# Altium schematic sheet 01 REVISION HISTORY.SchDoc
size 420 x 297 mm; Organization: Altium Limited; Address1: L3, 12a Rodborough Rd; Address2: Frenchs Forest; Address3: NSW; Address4: Australia 2086
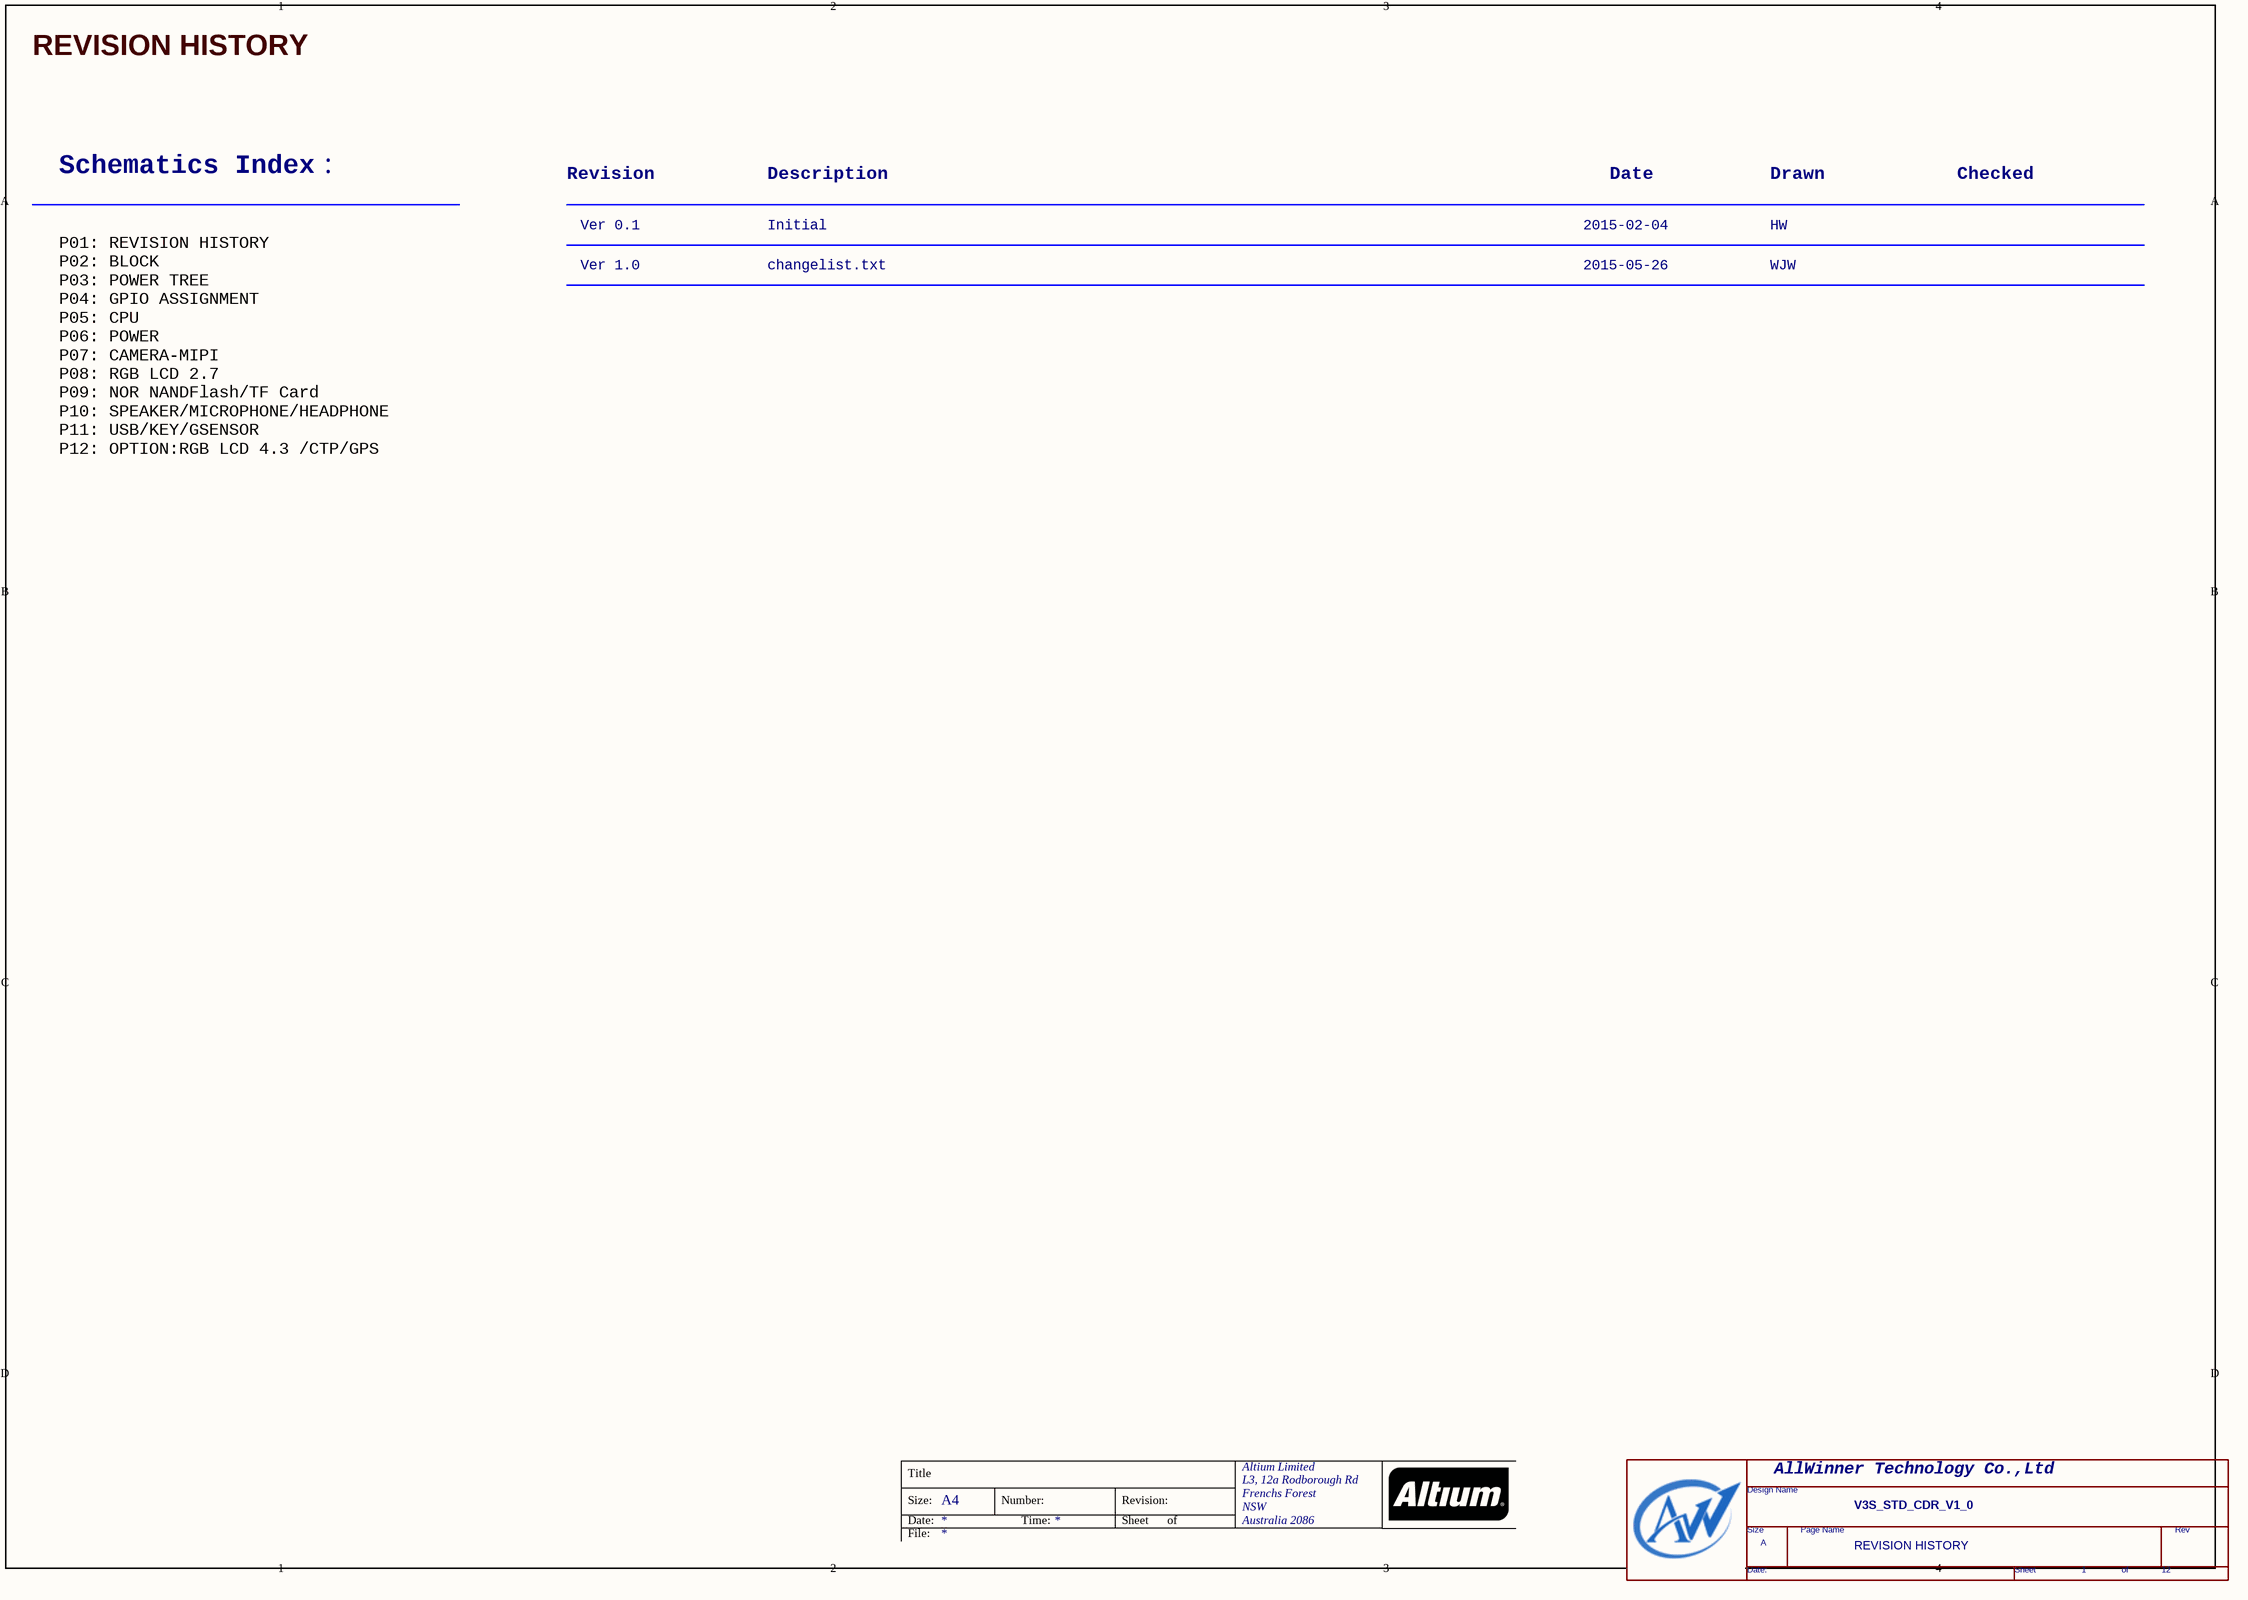
[diagram p0: 01 REVISION HISTORY.SchDoc]

## Parts
*  Page Count: 12  Page Number: 1  Page Size: A  Title: V3S_STD_CDR_V1_0  Doc: REVISION HISTORY  (hidden comment: TitleBlock0-AW)  (graphical)

## Notes on the sheet
- REVISION HISTORY
- Schematics Index：
- Revision
- Description
- Date
- Drawn
- Checked
- Ver 0.1
- Initial
- 2015-02-04
- HW
- Ver 1.0
- changelist.txt
- 2015-05-26
- WJW
- P01: REVISION HISTORY
  P02: BLOCK
  P03: POWER TREE
  P04: GPIO ASSIGNMENT
  P05: CPU
  P06: POWER
  P07: CAMERA-MIPI
  P08: RGB LCD 2.7
  P09: NOR NANDFlash/TF Card
  P10: SPEAKER/MICROPHONE/HEADPHONE
  P11: USB/KEY/GSENSOR
  P12: OPTION:RGB LCD 4.3 /CTP/GPS
- Title
- Size:
- Date:
- A4
- Number:
- Time:
- Revision:
- Sheet
- of
- File:
- (in symbol TitleBlock0-AW) AllWinner Technology Co.,Ltd; Design Name; Size; Page Name; Rev; Date:; Sheet; of

## Library data of the parts
* = TitleBlock0-AW: RevCode: 0.1; Page Create Date: March  8, 1995